# Altium schematic sheet imagesensor.SchDoc
size A3
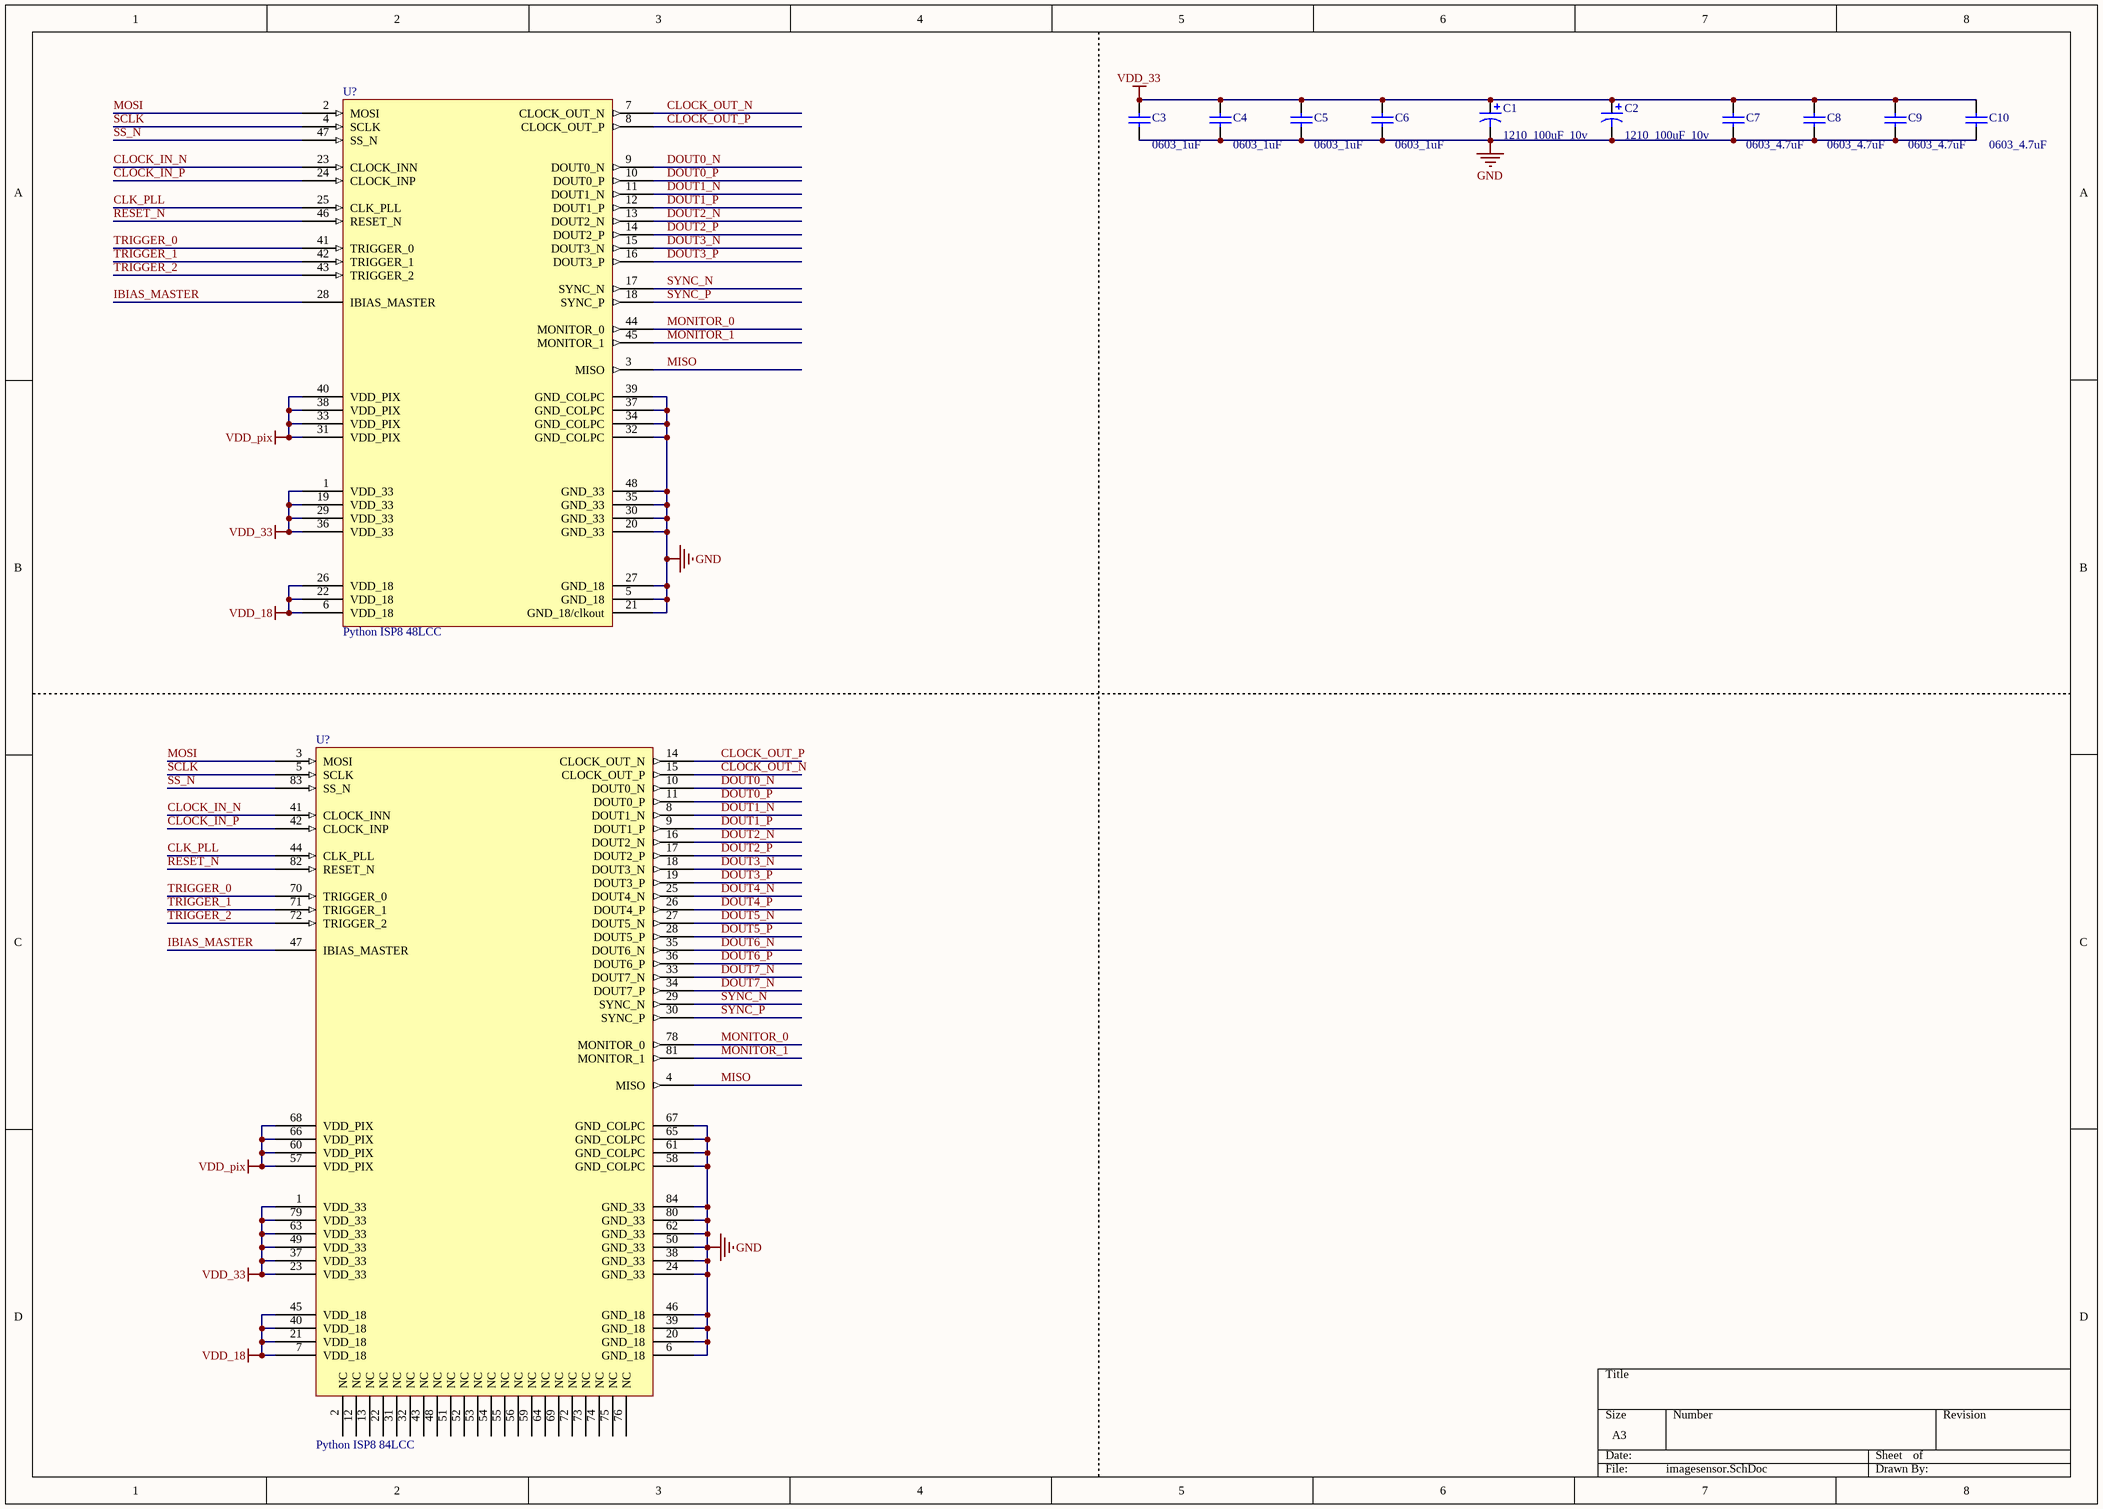
[diagram p0: imagesensor.SchDoc]

## Parts
(Parts that share a designator on the sheet are numbered #1, #2 ... from top to bottom, then left to right.)
C1  value 1210_100uF_10v  [CC3225-1210]  (hidden comment: T494B)
C2  value 1210_100uF_10v  [CC3225-1210]  (hidden comment: T494B)
C3  value 0603_1uF  [0603]  (hidden comment: C0603)
C4  value 0603_1uF  [0603]  (hidden comment: C0603)
C5  value 0603_1uF  [0603]  (hidden comment: C0603)
C6  value 0603_1uF  [0603]  (hidden comment: C0603)
C7  value 0603_4.7uF  [0603]  (hidden comment: C0603)
C8  value 0603_4.7uF  [0603]  (hidden comment: C0603)
C9  value 0603_4.7uF  [0603]  (hidden comment: C0603)
C10  value 0603_4.7uF  [0603]  (hidden comment: C0603)
U?#1  Python ISP8 48LCC  [LCC48]
U?#2  Python ISP8 84LCC  [PLCC84_L]

## Nets
GND: C1.2 C2.2 C3.1 C4.1 C5.1 C6.1 C7.1 C8.1 C9.1 C10.1 U?#1.5(GND_18) U?#1.20(GND_33) U?#1.21(GND_18/clkout) U?#1.27(GND_18) U?#1.30(GND_33) U?#1.32(GND_COLPC) U?#1.34(GND_COLPC) U?#1.35(GND_33) U?#1.37(GND_COLPC) U?#1.39(GND_COLPC) U?#1.48(GND_33) U?#2.6(GND_18) U?#2.20(GND_18) U?#2.24(GND_33) U?#2.38(GND_33) U?#2.39(GND_18) U?#2.46(GND_18) U?#2.50(GND_33) U?#2.58(GND_COLPC) U?#2.61(GND_COLPC) U?#2.62(GND_33) U?#2.65(GND_COLPC) U?#2.67(GND_COLPC) U?#2.80(GND_33) U?#2.84(GND_33)
VDD_18: U?#1.6(VDD_18) U?#1.22(VDD_18) U?#1.26(VDD_18) U?#2.7(VDD_18) U?#2.21(VDD_18) U?#2.40(VDD_18) U?#2.45(VDD_18)
VDD_33: C1.1 C2.1 C3.2 C4.2 C5.2 C6.2 C7.2 C8.2 C9.2 C10.2 U?#1.1(VDD_33) U?#1.19(VDD_33) U?#1.29(VDD_33) U?#1.36(VDD_33) U?#2.1(VDD_33) U?#2.23(VDD_33) U?#2.37(VDD_33) U?#2.49(VDD_33) U?#2.63(VDD_33) U?#2.79(VDD_33)
VDD_pix: U?#1.31(VDD_PIX) U?#1.33(VDD_PIX) U?#1.38(VDD_PIX) U?#1.40(VDD_PIX) U?#2.57(VDD_PIX) U?#2.60(VDD_PIX) U?#2.66(VDD_PIX) U?#2.68(VDD_PIX)
CLK_PLL: U?#1.25(CLK_PLL) U?#2.44(CLK_PLL)
CLOCK_IN_N: U?#1.23(CLOCK_INN) U?#2.41(CLOCK_INN)
CLOCK_IN_P: U?#1.24(CLOCK_INP) U?#2.42(CLOCK_INP)
CLOCK_OUT_N: U?#1.7(CLOCK_OUT_N) U?#2.15(CLOCK_OUT_P)
CLOCK_OUT_P: U?#1.8(CLOCK_OUT_P) U?#2.14(CLOCK_OUT_N)
DOUT0_N: U?#1.9(DOUT0_N) U?#2.10(DOUT0_N)
DOUT0_P: U?#1.10(DOUT0_P) U?#2.11(DOUT0_P)
DOUT1_N: U?#1.11(DOUT1_N) U?#2.8(DOUT1_N)
DOUT1_P: U?#1.12(DOUT1_P) U?#2.9(DOUT1_P)
DOUT2_N: U?#1.13(DOUT2_N) U?#2.16(DOUT2_N)
DOUT2_P: U?#1.14(DOUT2_P) U?#2.17(DOUT2_P)
DOUT3_N: U?#1.15(DOUT3_N) U?#2.18(DOUT3_N)
DOUT3_P: U?#1.16(DOUT3_P) U?#2.19(DOUT3_P)
DOUT4_N: U?#2.25(DOUT4_N)
DOUT4_P: U?#2.26(DOUT4_P)
DOUT5_N: U?#2.27(DOUT5_N)
DOUT5_P: U?#2.28(DOUT5_P)
DOUT6_N: U?#2.35(DOUT6_N)
DOUT6_P: U?#2.36(DOUT6_P)
DOUT7_N: U?#2.33(DOUT7_N) U?#2.34(DOUT7_P)
IBIAS_MASTER: U?#1.28(IBIAS_MASTER) U?#2.47(IBIAS_MASTER)
MISO: U?#1.3(MISO) U?#2.4(MISO)
MONITOR_0: U?#1.44(MONITOR_0) U?#2.78(MONITOR_0)
MONITOR_1: U?#1.45(MONITOR_1) U?#2.81(MONITOR_1)
MOSI: U?#1.2(MOSI) U?#2.3(MOSI)
RESET_N: U?#1.46(RESET_N) U?#2.82(RESET_N)
SCLK: U?#1.4(SCLK) U?#2.5(SCLK)
SS_N: U?#1.47(SS_N) U?#2.83(SS_N)
SYNC_N: U?#1.17(SYNC_N) U?#2.29(SYNC_N)
SYNC_P: U?#1.18(SYNC_P) U?#2.30(SYNC_P)
TRIGGER_0: U?#1.41(TRIGGER_0) U?#2.70(TRIGGER_0)
TRIGGER_1: U?#1.42(TRIGGER_1) U?#2.71(TRIGGER_1)
TRIGGER_2: U?#1.43(TRIGGER_2) U?#2.72(TRIGGER_2)

Not connected (* = marked no-connect by the designer): U?#2 2(NC) 12(NC) 13(NC) 22(NC) 31(NC) 32(NC) 43(NC) 48(NC) 51(NC) 52(NC) 53(NC) 54(NC) 55(NC) 56(NC) 59(NC) 64(NC) 69(NC) 73(NC) 74(NC) 75(NC) 76(NC)

## Library data of the parts
C1 C2 = T494B: Solid Tantalum Chip Capacitor, Standard T494 Series - Low ESR, Industrial Grade; Published: 17-Jul-2002; LatestRevisionDate: 19-Mar-2004; LatestRevisionNote: Silkscreen dimensions re-sized.; DatasheetDocument: Mar-2001; PackageDocument: Mar-2001; PackageReference: B; Publisher: Altium Limited; Code_JEITA: 3528-21; ComponentLink1Description: Manufacturer Link; ComponentLink1URL: http://www.kemet.com/; ComponentLink2Description: Datasheet; ComponentLink2URL: http://www.kemet.com/kemet/web/homepage/kechome.nsf/vapubfilesname/F3102TA.pdf/$file/F3102TA.pdf
C3-C10 = C0603: Ceramic Chip Capacitor - Standard; Note: Footprint corresponds to dimensions for bulk cassette packaging. This case size has tightened tolerances.; Published: 17-Jul-2002; LatestRevisionDate: 19-Mar-2004; LatestRevisionNote: Silkscreen size reduced.; DatasheetDocument: Mar-2001; PackageDocument: Mar-2001; PackageReference: 0603; Publisher: Altium Limited; Code_JEITA: 0603; Code_IPC: 1608 [0603]; ComponentLink1Description: Manufacturer Link; ComponentLink1URL: http://www.kemet.com/; ComponentLink2Description: Datasheet; ComponentLink2URL: http://www.kemet.com/kemet/web/homepage/kechome.nsf/vapubfilesname/F3102TA.pdf/$file/F3102TA.pdf
U?#1 = Python ISP8 48LCC: Python ISP8 28LCC; Published: 23-Sep-2002; LatestRevisionDate: 13-Apr-2006; LatestRevisionNote: IPC-7351 Footprint Added.; DatasheetVersion: Jul-1999; PackageVersion: ver14.3, Jul-2006; PackageReference: RQFP208; Publisher: Altium Limited; PackageDescription: 208-Pin Power Quad Flat Pack (RQFP208); Code_JEDEC: MS-029-FA-1; ComponentLink1Description: Manufacturer Link; ComponentLink1URL: http://www.altera.com/products/devices/max9k/m9k-index.html; ComponentLink2Description: Datasheet; ComponentLink2URL: http://www.altera.com/literature/ds/m9000.pdf
U?#2 = Python ISP8 84LCC: MAX 9000 PLD with 191 I/O Pins, 240-Pin RQFP, Industrial Grade; Published: 23-Sep-2002; LatestRevisionDate: 13-Apr-2006; LatestRevisionNote: IPC-7351 Footprint Added.; DatasheetVersion: Jul-1999; PackageVersion: ver14.2, Oct-2005; PackageReference: RQFP240; Publisher: Altium Limited; PackageDescription: 240-Pin Power Quad Flat Pack (RQFP240); Supplier 1: Digi-Key; Supplier Part Number 1: 544-2365-ND; Code_JEDEC: MS-029-GA; ComponentLink1Description: Manufacturer Link; ComponentLink1URL: http://www.altera.com/products/devices/max9k/m9k-index.html; ComponentLink2Description: Datasheet; ComponentLink2URL: http://www.altera.com/literature/ds/m9000.pdf